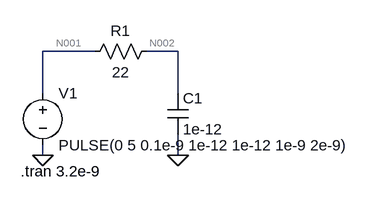
[diagram p0: schematic tiefpass_rgb.asc]
tiefpass_rgb.asc, the LTspice schematic file:
Version 4
SHEET 1 880 680
WIRE 176 64 96 64
WIRE 304 64 256 64
WIRE 96 128 96 64
WIRE 304 128 304 64
WIRE 96 224 96 208
WIRE 304 224 304 192
FLAG 96 224 0
FLAG 304 224 0
SYMBOL voltage 96 112 R0
WINDOW 123 0 0 Left 2
WINDOW 39 0 0 Left 2
SYMATTR InstName V1
SYMATTR Value PULSE(0 5 0.1e-9 1e-12 1e-12 1e-9 2e-9)
SYMBOL res 272 48 R90
WINDOW 0 0 56 VBottom 2
WINDOW 3 32 56 VTop 2
SYMATTR InstName R1
SYMATTR Value 22
SYMBOL cap 288 128 R0
SYMATTR InstName C1
SYMATTR Value 1e-12
TEXT 62 248 Left 2 !.tran 3.2e-9

The netlist it stands for:
* tiefpass_rgb.asc
V1 N001 0 PULSE(0 5 0.1e-9 1e-12 1e-12 1e-9 2e-9)
R1 N002 N001 22
C1 N002 0 1e-12
.tran 3.2e-9
.backanno
.end

* Results of the author's LTspice run, read from the files saved beside the schematic
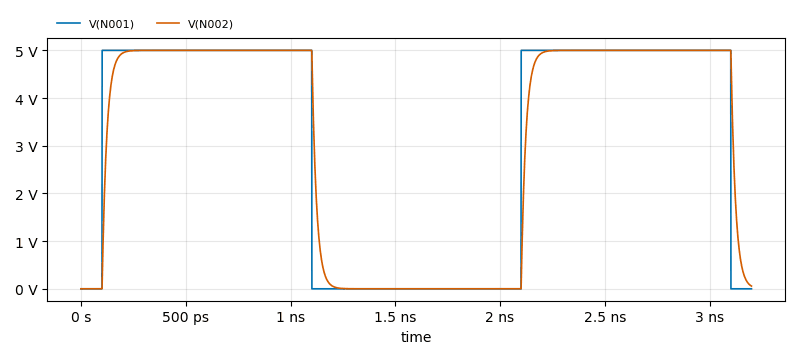
[diagram p1: Transient Analysis of tiefpass_rgb.asc, plotted from the saved traces]
* Transient Analysis, 1 run:
*   V(N001): min 0 V, max 5 V, average 3.128 V, rms 3.954 V, last 0 V
*   V(N002): min 0 V, max 5 V, average 3.128 V, rms 3.912 V, last 56.42 mV